# Altium project RadioFEM.PrjPcb
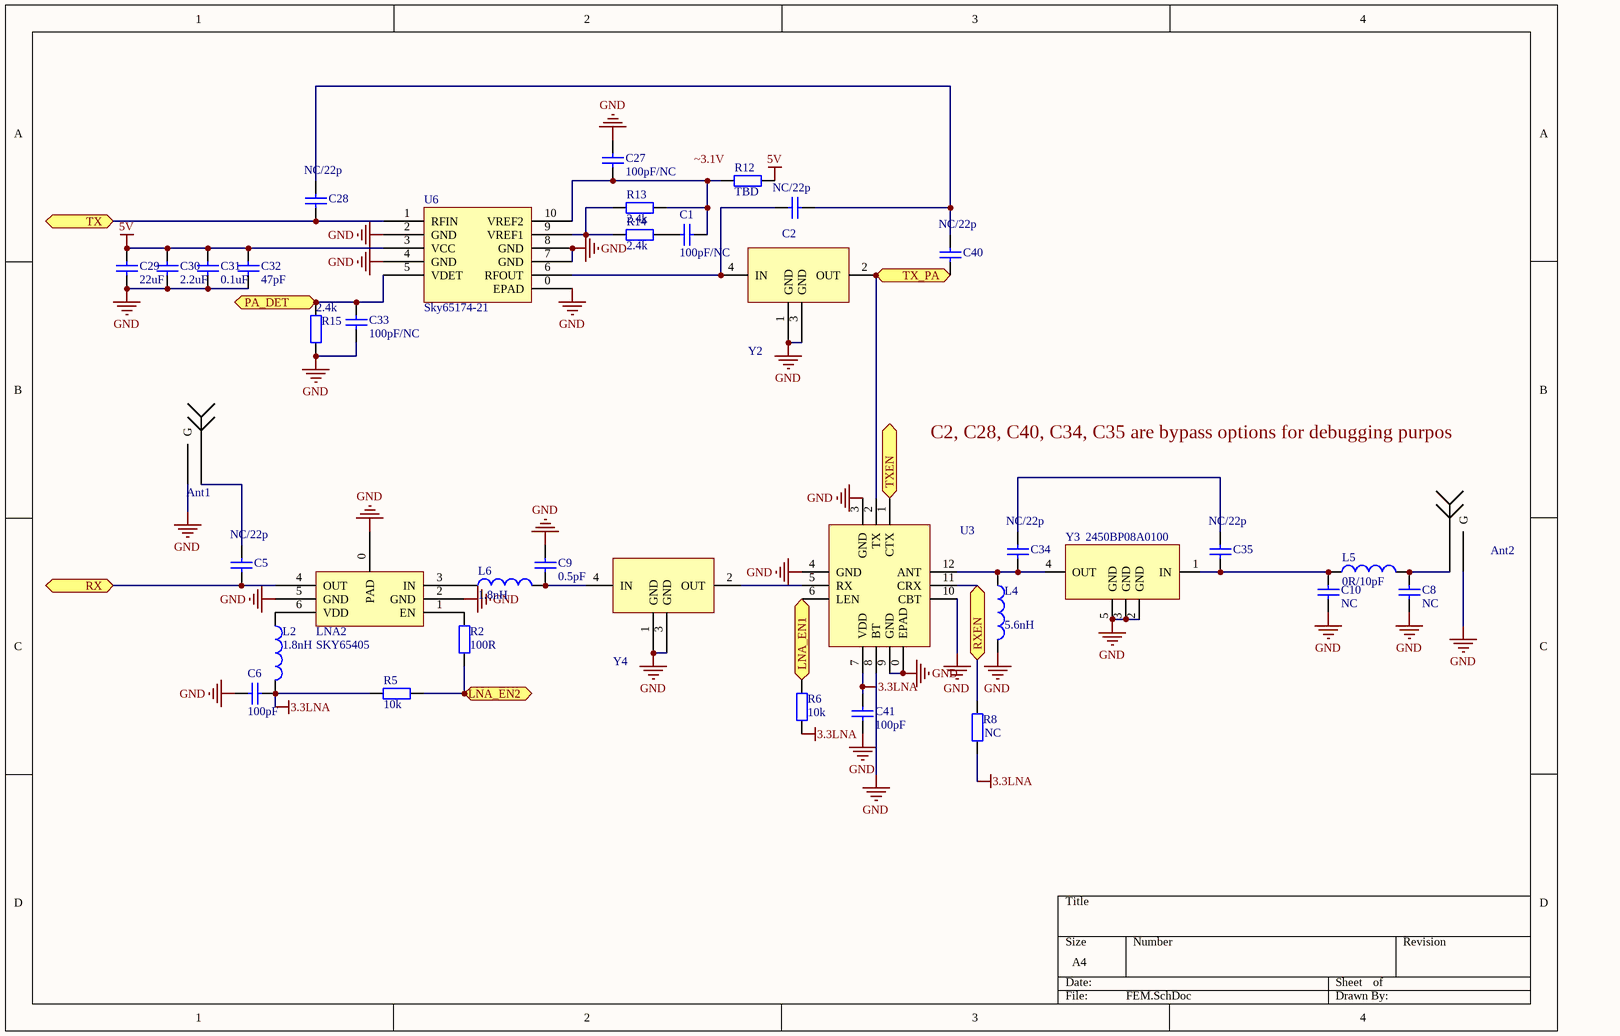
[diagram p0: FEM.SchDoc]
3 sheets, 104 parts. Net scope: flat (ports and power ports of the same name join across sheets).
Board file: RadioFEM.PcbDoc
Sheets:
  FEM.SchDoc
  Radio.SchDoc
  power&interface.SchDoc

## Sheet FEM.SchDoc
size A4

### Parts
Ant1  Antenna  [SMA-2]  (value not drawn)
Ant2  Antenna  [SMA-2]  (value not drawn)
C1  value 100pF/NC  [0402]  (hidden comment: Cap)
C2  NC/22p  [0402]
C5  NC/22p  [0402]
C6  value 100pF  [0402]  (hidden comment: Cap)
C8  value NC  [0402]  (hidden comment: Cap)
C9  value 0.5pF  [0402]  (hidden comment: Cap)
C10  value NC  [0402]  (hidden comment: Cap)
C27  value 100pF/NC  [0402]  (hidden comment: Cap)
C28  NC/22p  [0402]
C29  value 22uF  [0805]  (hidden comment: Cap)
C30  value 2.2uF  [0603]  (hidden comment: Cap)
C31  value 0.1uF  [0402]  (hidden comment: Cap)
C32  value 47pF  [0402]  (hidden comment: Cap)
C33  value 100pF/NC  [0402]  (hidden comment: Cap)
C34  NC/22p  [0402]
C35  NC/22p  [0402]
C40  NC/22p  [0402]
C41  value 100pF  [0402]  (hidden comment: Cap)
L2  value 1.8nH  [0402]  (hidden comment: Inductor)
L4  5.6nH  [0402]
L5  value 0R/10pF  [0402]  (hidden comment: Inductor)
L6  value 1.8nH  [0402]  (hidden comment: Inductor)
LNA2  SKY65405  [SKY65404-31]
R2  value 100R  [0402]  (hidden comment: Res2)
R5  value 10k  [0402]
R6  value 10k  [0402]
R8  NC  [0402]
R12  value TBD  [0402]  (hidden comment: Res2)
R13  value 2.4k  [0402]  (hidden comment: Res2)
R14  value 2.4k  [0402]  (hidden comment: Res2)
R15  value 2.4k  [0402]  (hidden comment: Res2)
U3  SKY85203  [SKY85203]  (value not drawn)
U6  Sky65174-21  [SKY65174-21]
Y2  2450BP39C100A  [2450BP39C100A]  (value not drawn)
Y3  2450BP08A0100  [2450BP08A0100]
Y4  2450BP39C100A  [2450BP39C100A]  (value not drawn)

### Ports
LNA_EN1, LNA_EN2, PA_DET, RX, RXEN, TX, TX_PA, TXEN

### Nets
3.3LNA: C6.2 C41.2 L2.2 R5.1 R6.1 R8.1 U3.7(VDD)
5V: C29.1 C30.1 C31.1 C32.1 R12.1 U6.3(VCC)
GND: Ant1.GND(G) Ant2.GND(G) C6.1 C8.1 C9.1 C10.1 C27.1 C29.2 C30.2 C31.2 C32.2 C33.2 C41.1 L4.2 LNA2.0(PAD) LNA2.2(GND) LNA2.5(GND) R15.1 U3.0(EPAD) U3.3(GND) U3.4(GND) U3.8(BT) U3.9(GND) U3.10(CBT) U6.0(EPAD) U6.2(GND) U6.4(GND) U6.7(GND) U6.8(GND) Y2.1(GND) Y2.3(GND) Y3.2(GND) Y3.3(GND) Y3.5(GND) Y4.1(GND) Y4.3(GND)
NetAnt1_1: Ant1.1 C5.1
NetAnt2_1: Ant2.1 C8.2 L5.2
NetC1_1: C1.1 R14.1
NetC1_2: C1.2 C27.2 R12.2 R13.1 U6.10(VREF2)
NetC2_1: C2.1 U6.6(RFOUT) Y2.4(IN)
NetC2_2: C2.2 C28.2 C40.1
NetC5_2: C5.2 LNA2.4(OUT) ; port RX
NetC9_2: C9.2 L6.2 Y4.4(IN)
NetC10_2: C10.2 C35.1 L5.1 Y3.1(IN)
NetC28_1: C28.1 U6.1(RFIN) ; port TX
NetC33_1: C33.1 R15.2 U6.5(VDET) ; port PA_DET
NetC34_1: C34.1 C35.2
NetC34_2: C34.2 L4.1 U3.12(ANT) Y3.4(OUT)
NetC40_2: C40.2 U3.2(TX) Y2.2(OUT) ; port TX_PA
NetL2_1: L2.1 LNA2.6(VDD)
NetL6_1: L6.1 LNA2.3(IN)
NetLNA2_1: LNA2.1(EN) R2.1
NetR2_2: R2.2 R5.2 ; port LNA_EN2
NetR6_2: R6.2 U3.6(LEN) ; port LNA_EN1
NetR8_2: R8.2 U3.11(CRX) ; port RXEN
NetR13_2: R13.2 R14.2 U6.9(VREF1)
NetT13_1: U3.1(CTX) ; port TXEN
NetU3_5: U3.5(RX) Y4.2(OUT)

### Notes on the sheet
- C2, C28, C40, C34, C35 are bypass options for debugging purpos
- Labels drawn without touching a wire or pin: ~3.1V

### Library data of the parts
C1 C2 C5 C6 C8-C10 C27-C35 C40 C41 = Cap: Capacitor; Published: 8-Jun-2000; LatestRevisionDate: 17-Jul-2002; LatestRevisionNote: Re-released for DXP Platform.; PackageReference: RAD-0.3; Publisher: Altium Limited; PackageDescription: Radial Cap, Thru-Hole; 2 Leads; 0.3 in Pin Spacing
L2 L4-L6 = Inductor: Code_IEC: 1005; Published: 8-Jun-2000; LatestRevisionDate: 29-May-2009; LatestRevisionNote: IPC-7351 Footprint Added.; PackageReference: 0402-A; Publisher: Altium Limited; PackageDescription: Chip Inductor; Code_JEITA: 0402
LNA2 = SKY65404-31
R2 R5 R6 R8 R12-R15 = Res2: Resistor; Published: 8-Jun-2000; LatestRevisionDate: 17-Jul-2002; LatestRevisionNote: Re-released for DXP Platform.; PackageReference: AXIAL-0.4; Publisher: Altium Limited; PackageDescription: Axial Device, Thru-Hole; 2 Leads; 0.4 in Pin Spacing

## Sheet Radio.SchDoc
size A4
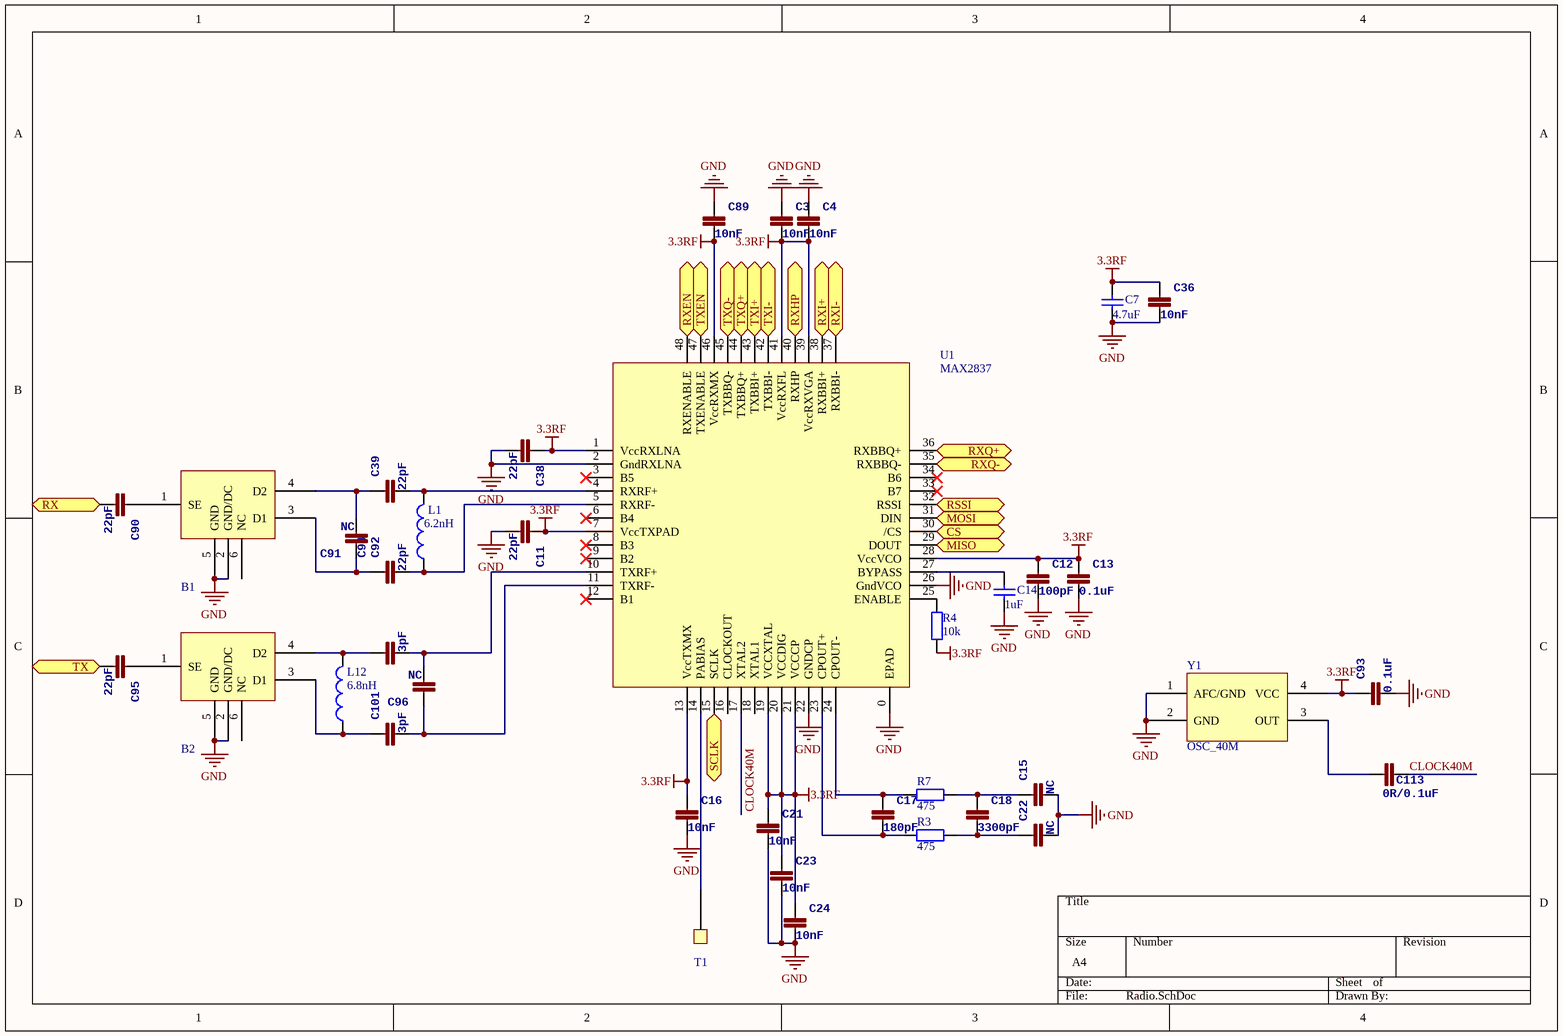
[diagram p1: Radio.SchDoc]

### Parts
B1  Balun  [HHM1711D1/HHM1732B1]  (value not drawn)
B2  Balun  [HHM1711D1/HHM1732B1]  (value not drawn)
C3  10nF  [0402]
C4  10nF  [0402]
C7  4.7uF  [0603]
C11  22pF  [0402]
C12  100pF  [0402]
C13  0.1uF  [0402]
C14  1uF  [0603]
C15  NC  [0402]
C16  10nF  [0402]
C17  180pF  [0402]
C18  3300pF  [0402]
C21  10nF  [0402]
C22  NC  [0402]
C23  10nF  [0402]
C24  10nF  [0402]
C36  10nF  [0402]
C38  22pF  [0402]
C39  22pF  [0402]
C89  10nF  [0402]
C90  22pF  [0402]
C91  NC  [0402]
C92  22pF  [0402]
C93  0.1uF  [0402]
C94  3pF  [0402]
C95  22pF  [0402]
C96  NC  [0402]
C101  3pF  [0402]
C113  0R/0.1uF  [0402]
L1  6.2nH  [0402]
L12  value 6.8nH  [0402]  (hidden comment: NC)
R3  475  [0402]
R4  10k  [0402]
R7  475  [0402]
T1  PABIAS  [TestPad - 1mm]  (value not drawn)
U1  MAX2837  [MAX2837]
Y1  OSC_40M  [TXC_7Q]

### Ports
CS, MISO, MOSI, RSSI, RX, RXEN, RXHP, RXI+, RXI-, RXQ+, RXQ-, SCLK, TX, TXEN, TXI+, TXI-, TXQ+, TXQ-

### Nets
3.3RF: C3.2 C4.2 C7.2 C11.1 C12.1 C13.1 C16.1 C21.1 C23.1 C24.1 C36.1 C38.1 C89.2 C93.1 R4.1 U1.1(VccRXLNA) U1.7(VccTXPAD) U1.13(VccTXMX) U1.19(VCCXTAL) U1.20(VCCDIG) U1.21(VCCCP) U1.28(VccVCO) U1.39(VccRXVGA) U1.41(VccRXFL) U1.46(VccRXMX) Y1.4(VCC)
GND: B1.2(GND/DC) B1.5(GND) B2.2(GND/DC) B2.5(GND) C3.1 C4.1 C7.1 C11.2 C12.2 C13.2 C14.1 C15.2 C16.2 C21.2 C22.2 C23.2 C24.2 C36.2 C38.2 C89.1 C93.2 U1.0(EPAD) U1.2(GndRXLNA) U1.22(GNDCP) U1.26(GndVCO) Y1.1(AFC/GND) Y1.2(GND)
CLOCK40M: C113.2 U1.17(XTAL2)
NetB1_1: B1.1(SE) C90.1
NetB1_3: B1.3(D1) C91.1 C92.1
NetB1_4: B1.4(D2) C39.1 C91.2
NetB2_1: B2.1(SE) C95.1
NetB2_3: B2.3(D1) C101.1 L12.1
NetB2_4: B2.4(D2) C94.1 L12.2
NetC5_2: C90.2 ; port RX
NetC14_2: C14.2 U1.27(BYPASS)
NetC15_1: C15.1 C18.1 R7.1
NetC17_1: C17.1 R7.2 U1.24(CPOUT-)
NetC17_2: C17.2 R3.2 U1.23(CPOUT+)
NetC18_2: C18.2 C22.1 R3.1
NetC28_1: C95.2 ; port TX
NetC39_2: C39.2 L1.2 U1.4(RXRF+)
NetC92_2: C92.2 L1.1 U1.5(RXRF-)
NetC94_2: C94.2 C96.2 U1.10(TXRF+)
NetC96_1: C96.1 C101.2 U1.11(TXRF-)
NetC113_1: C113.1 Y1.3(OUT)
NetR4_2: R4.2 U1.25(ENABLE)
NetR8_2: U1.48(RXENABLE) ; port RXEN
NetT1_1: T1.1 U1.14(PABIAS)
NetT2_1: U1.37(RXBBI-) ; port RXI-
NetT3_1: U1.38(RXBBI+) ; port RXI+
NetT4_1: U1.36(RXBBQ+) ; port RXQ+
NetT6_1: U1.35(RXBBQ-) ; port RXQ-
NetT7_1: U1.42(TXBBI-) ; port TXI-
NetT8_1: U1.43(TXBBI+) ; port TXI+
NetT9_1: U1.44(TXBBQ+) ; port TXQ+
NetT10_1: U1.45(TXBBQ-) ; port TXQ-
NetT11_1: U1.40(RXHP) ; port RXHP
NetT13_1: U1.47(TXENABLE) ; port TXEN
NetT14_1: U1.32(RSSI) ; port RSSI
NetT15_1: U1.31(DIN) ; port MOSI
NetT16_1: U1.30(/CS) ; port CS
NetT17_1: U1.29(DOUT) ; port MISO
NetT18_1: U1.15(SCLK) ; port SCLK

Not connected (* = marked no-connect by the designer): B1 6(NC); B2 6(NC); U1 3(B5)* 6(B4)* 8(B3)* 9(B2)* 12(B1)* 16(CLOCKOUT) 18(XTAL1) 33(B7)* 34(B6)*

### Library data of the parts
C3 C4 C11-C13 C15-C18 C21-C24 C36 C38 C39 C89-C96 C101 C113 = CAP0402-CAP: <b>Capacitor</b> / Standard 0603 ceramic capacitor, and 0.1" leaded capacitor.; PARTNO: CC0402ZRY5V7BB104
C7 C14 = Cap: Capacitor; Published: 8-Jun-2000; LatestRevisionDate: 17-Jul-2002; LatestRevisionNote: Re-released for DXP Platform.; PackageReference: RAD-0.3; Publisher: Altium Limited; PackageDescription: Radial Cap, Thru-Hole; 2 Leads; 0.3 in Pin Spacing
L1 L12 = Inductor: Code_IEC: 1005; Published: 8-Jun-2000; LatestRevisionDate: 29-May-2009; LatestRevisionNote: IPC-7351 Footprint Added.; PackageReference: 0402-A; Publisher: Altium Limited; PackageDescription: Chip Inductor; Code_JEITA: 0402
R3 R4 R7 = Res2: Resistor; Published: 8-Jun-2000; LatestRevisionDate: 17-Jul-2002; LatestRevisionNote: Re-released for DXP Platform.; PackageReference: AXIAL-0.4; Publisher: Altium Limited; PackageDescription: Axial Device, Thru-Hole; 2 Leads; 0.4 in Pin Spacing
T1 = TestPad

## Sheet power&interface.SchDoc
size A4
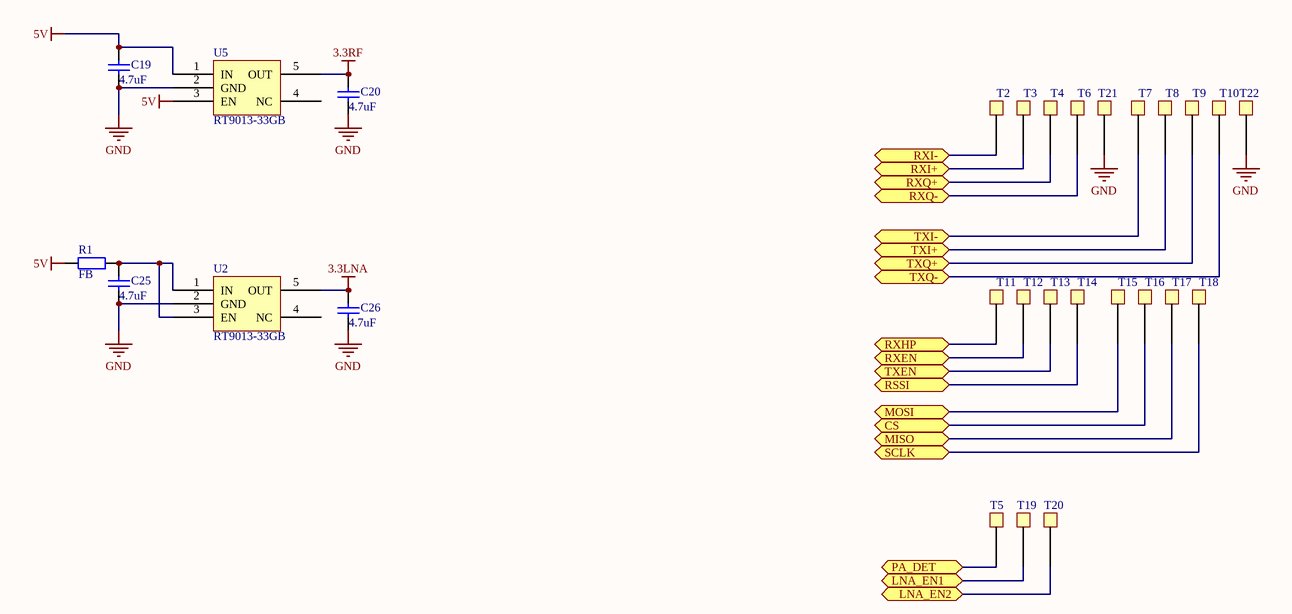
[diagram p2: power&interface.SchDoc]

### Parts
C19  4.7uF  [0603]
C20  4.7uF  [0603]
C25  4.7uF  [0603]
C26  4.7uF  [0603]
R1  FB  [0402]
T2  RXI-  [TestPad - 1mm]  (value not drawn)
T3  RXI-  [TestPad - 1mm]  (value not drawn)
T4  RXI-  [TestPad - 1mm]  (value not drawn)
T5  DET  [TestPad - 1mm]  (value not drawn)
T6  RXI-  [TestPad - 1mm]  (value not drawn)
T7  RXI-  [TestPad - 1mm]  (value not drawn)
T8  RXI-  [TestPad - 1mm]  (value not drawn)
T9  RXI-  [TestPad - 1mm]  (value not drawn)
T10  RXI-  [TestPad - 1mm]  (value not drawn)
T11  HP  [TestPad - 1mm]  (value not drawn)
T12  RX  [TestPad - 1mm]  (value not drawn)
T13  TX  [TestPad - 1mm]  (value not drawn)
T14  RSSI  [TestPad - 1mm]  (value not drawn)
T15  I  [TestPad - 1mm]  (value not drawn)
T16  CS  [TestPad - 1mm]  (value not drawn)
T17  O  [TestPad - 1mm]  (value not drawn)
T18  C  [TestPad - 1mm]  (value not drawn)
T19  L1  [TestPad - 1mm]  (value not drawn)
T20  L2  [TestPad - 1mm]  (value not drawn)
T21  VDET  [TestPad - 1mm]  (value not drawn)
T22  VDET  [TestPad - 1mm]  (value not drawn)
U2  RT9013-33GB  [SOT23-5]
U5  RT9013-33GB  [SOT23-5]

### Ports
CS, LNA_EN1, LNA_EN2, MISO, MOSI, PA_DET, RSSI, RXEN, RXHP, RXI+, RXI-, RXQ+, RXQ-, SCLK, TXEN, TXI+, TXI-, TXQ+, TXQ-

### Nets
3.3LNA: C26.2 U2.5(OUT)
3.3RF: C20.2 U5.5(OUT)
5V: C19.2 R1.2 U5.1(IN) U5.3(EN)
GND: C19.1 C20.1 C25.1 C26.1 T21.1 T22.1 U2.2(GND) U5.2(GND)
NetC25_2: C25.2 R1.1 U2.1(IN) U2.3(EN)
NetC33_1: T5.1 ; port PA_DET
NetR2_2: T20.1 ; port LNA_EN2
NetR6_2: T19.1 ; port LNA_EN1
NetR8_2: T12.1 ; port RXEN
NetT2_1: T2.1 ; port RXI-
NetT3_1: T3.1 ; port RXI+
NetT4_1: T4.1 ; port RXQ+
NetT6_1: T6.1 ; port RXQ-
NetT7_1: T7.1 ; port TXI-
NetT8_1: T8.1 ; port TXI+
NetT9_1: T9.1 ; port TXQ+
NetT10_1: T10.1 ; port TXQ-
NetT11_1: T11.1 ; port RXHP
NetT13_1: T13.1 ; port TXEN
NetT14_1: T14.1 ; port RSSI
NetT15_1: T15.1 ; port MOSI
NetT16_1: T16.1 ; port CS
NetT17_1: T17.1 ; port MISO
NetT18_1: T18.1 ; port SCLK

Not connected (* = marked no-connect by the designer): U2 4(NC); U5 4(NC)

### Library data of the parts
C19 C20 C25 C26 = Cap: Capacitor; Published: 8-Jun-2000; LatestRevisionDate: 17-Jul-2002; LatestRevisionNote: Re-released for DXP Platform.; PackageReference: RAD-0.3; Publisher: Altium Limited; PackageDescription: Radial Cap, Thru-Hole; 2 Leads; 0.3 in Pin Spacing
R1 = Res2: Resistor; Published: 8-Jun-2000; LatestRevisionDate: 17-Jul-2002; LatestRevisionNote: Re-released for DXP Platform.; PackageReference: AXIAL-0.4; Publisher: Altium Limited; PackageDescription: Axial Device, Thru-Hole; 2 Leads; 0.4 in Pin Spacing
T2-T22 = TestPad
U2 U5 = LP5907

## Nets that join several sheets
3.3LNA: FEM (7 pins), power&interface (C26.2 U2.5)
3.3RF: Radio (26 pins), power&interface (C20.2 U5.5)
5V: FEM (6 pins), power&interface (C19.2 R1.2 U5.1 U5.3)
GND: FEM (36 pins), Radio (27 pins), power&interface (8 pins)
NetC5_2: FEM (C5.2 LNA2.4), Radio (C90.2)
NetC28_1: FEM (C28.1 U6.1), Radio (C95.2)
NetC33_1: FEM (C33.1 R15.2 U6.5), power&interface (T5.1)
NetR2_2: FEM (R2.2 R5.2), power&interface (T20.1)
NetR6_2: FEM (R6.2 U3.6), power&interface (T19.1)
NetR8_2: FEM (R8.2 U3.11), Radio (U1.48), power&interface (T12.1)
NetT2_1: Radio (U1.37), power&interface (T2.1)
NetT3_1: Radio (U1.38), power&interface (T3.1)
NetT4_1: Radio (U1.36), power&interface (T4.1)
NetT6_1: Radio (U1.35), power&interface (T6.1)
NetT7_1: Radio (U1.42), power&interface (T7.1)
NetT8_1: Radio (U1.43), power&interface (T8.1)
NetT9_1: Radio (U1.44), power&interface (T9.1)
NetT10_1: Radio (U1.45), power&interface (T10.1)
NetT11_1: Radio (U1.40), power&interface (T11.1)
NetT13_1: FEM (U3.1), Radio (U1.47), power&interface (T13.1)
NetT14_1: Radio (U1.32), power&interface (T14.1)
NetT15_1: Radio (U1.31), power&interface (T15.1)
NetT16_1: Radio (U1.30), power&interface (T16.1)
NetT17_1: Radio (U1.29), power&interface (T17.1)
NetT18_1: Radio (U1.15), power&interface (T18.1)